# Altium schematic sheet Current sensors.SchDoc
size A4; SheetNumber: 4; SheetTotal: 4
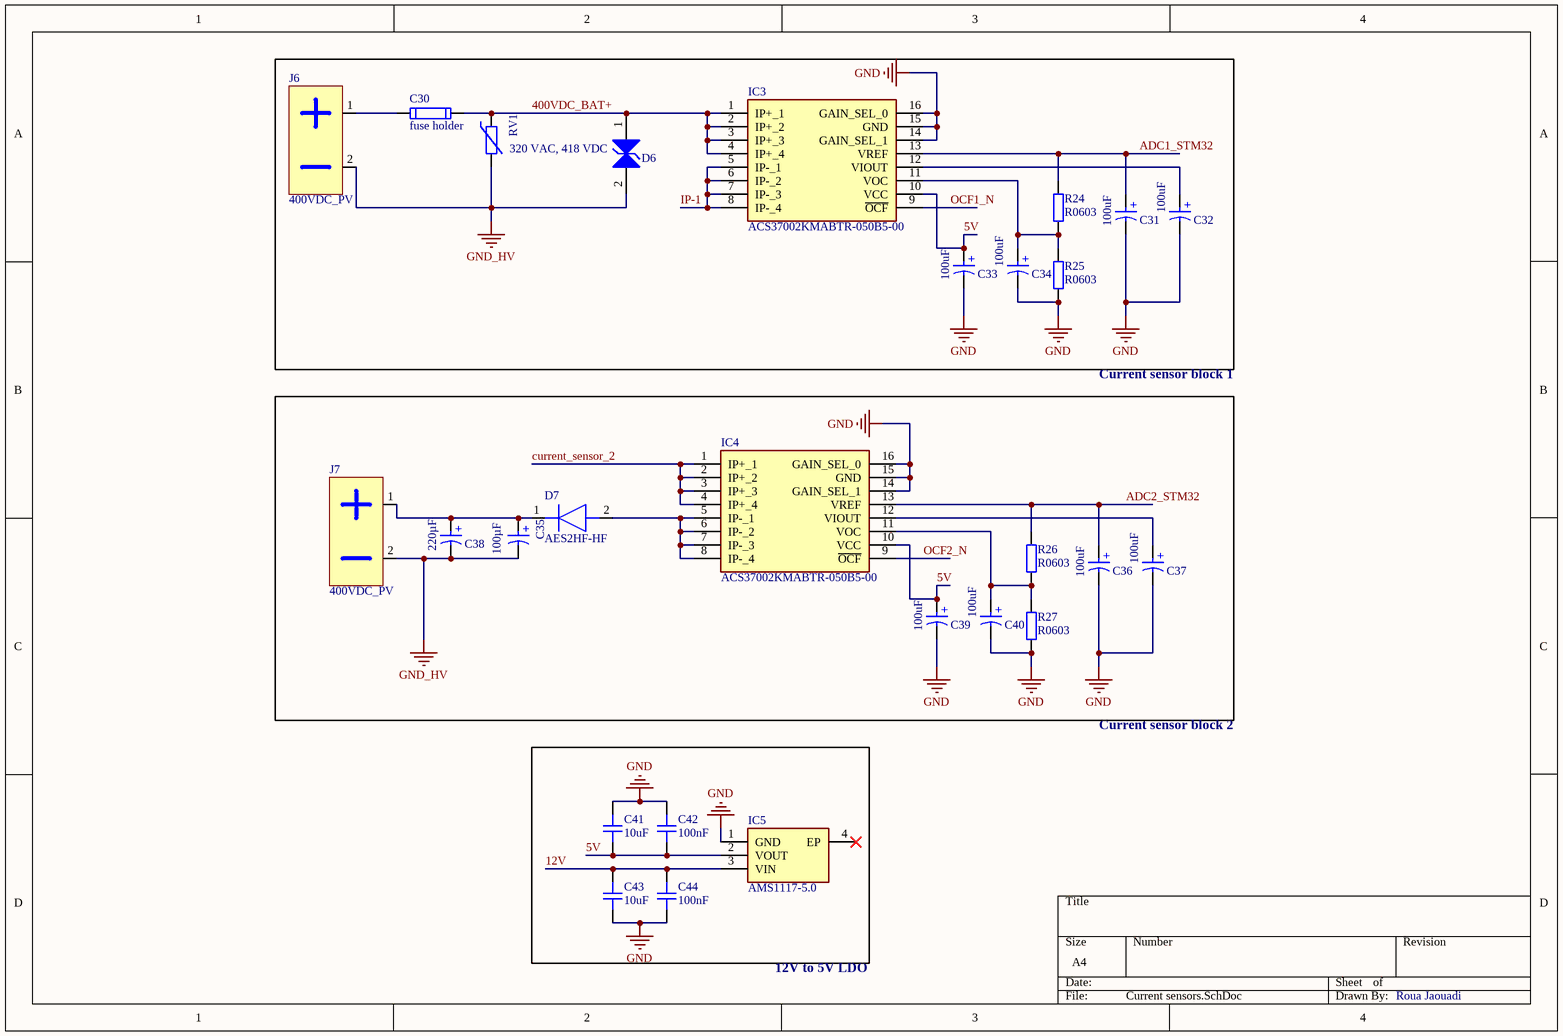
[diagram p0: Current sensors.SchDoc]

## Parts
C30  fuse holder  [696108003002]
C31  100uF  [WCAP-ATG8_D5H11]
C32  100uF  [WCAP-ATG8_D5H11]
C33  100uF  [WCAP-ATG8_D5H11]
C34  100uF  [WCAP-ATG8_D5H11]
C35  100µF  [WCAP-AT1H_D16H35.5]
C36  100uF  [WCAP-ATG8_D5H11]
C37  100uF  [WCAP-ATG8_D5H11]
C38  220µF  [WCAP-AIE8_D25H40]
C39  100uF  [WCAP-ATG8_D5H11]
C40  100uF  [WCAP-ATG8_D5H11]
C41  10uF  [CAP_0603]
C42  100nF  [CAP_0603]
C43  10uF  [CAP_0603]
C44  100nF  [CAP_0603]
D6  600W, 5VDC  [WE-TVSP_DO-214AA_Bidirectional]  (value not drawn)
D7  AES2HF-HF  [SODFL5226X110N]
IC3  ACS37002KMABTR-050B5-00  [SOIC127P1030X265-16N]
IC4  ACS37002KMABTR-050B5-00  [SOIC127P1030X265-16N]
IC5  AMS1117-5.0  [SOT290P700X180-4N]
J6  400VDC_PV  [XT60PW-F]
J7  400VDC_PV  [XT60PW-F]
R24  R0603  [RES_0603]
R25  R0603  [RES_0603]
R26  R0603  [RES_0603]
R27  R0603  [RES_0603]
RV1  320 VAC, 418 VDC  [D16.5W7.2H20.5P1.6]

## Blocks framed on the sheet
Current sensor block 1: C35-C40 D7 IC4 J7 R26 R27

## Nets
GND: C31.2(N) C32.2(N) C33.2(N) C34.2(N) C36.2(N) C37.2(N) C39.2(N) C40.2(N) C41.1 C42.1 C43.2 C44.2 IC3.14(GAIN_SEL_1) IC3.15(GND) IC3.16(GAIN_SEL_0) IC4.14(GAIN_SEL_1) IC4.15(GND) IC4.16(GAIN_SEL_0) IC5.1(GND) R25.2 R27.2
GND_HV: C35.2(N) C38.2(N) D6.2 J6.2(V-) J7.2(V-) RV1.2
5V: C33.1(P) C39.1(P) C41.2 C42.2 IC3.10(VCC) IC4.10(VCC) IC5.2(VOUT)
12V: C43.1 C44.1 IC5.3(VIN)
400VDC_BAT+: C30.2 D6.1 IC3.1(IP+_1) IC3.2(IP+_2) IC3.3(IP+_3) IC3.4(IP+_4) RV1.1
ADC1_STM32: C31.1(P) IC3.13(VREF) R24.1
ADC2_STM32: C36.1(P) IC4.13(VREF) R26.1
current_sensor_2: IC4.1(IP+_1) IC4.2(IP+_2) IC4.3(IP+_3) IC4.4(IP+_4)
IP-1: IC3.5(IP-_1) IC3.6(IP-_2) IC3.7(IP-_3) IC3.8(IP-_4)
OCF1_N: IC3.9(~{OCF})
OCF2_N: IC4.9(~{OCF})
NetC30_1: C30.1 J6.1(V+)
NetC32_1: C32.1(P) IC3.12(VIOUT)
NetC34_1: C34.1(P) IC3.11(VOC) R24.2 R25.1
NetC35_1: C35.1(P) C38.1(P) D7.1(K) J7.1(V+)
NetC37_1: C37.1(P) IC4.12(VIOUT)
NetC40_1: C40.1(P) IC4.11(VOC) R26.2 R27.1
NetD7_2: D7.2(A) IC4.5(IP-_1) IC4.6(IP-_2) IC4.7(IP-_3) IC4.8(IP-_4)

Not connected (* = marked no-connect by the designer): IC5 4(EP)*

## Notes on the sheet
- Current sensor block 2
- 12V to 5V LDO
- Roua Jaouadi
- (in symbol 860010272005) +
- (in symbol 860241480001) +
- (in symbol 861221484011) +

## Library data of the parts
C30 = WE-FUSEHOLDER BLOCKS 696108003002: FUSEHOLDER BLOCKS - PCB - CLIP COVER - THT - WR-FSH; Manufacturer: W¨¹rth Elektronik eiSos GmbH; ComponentLink1 Description: Manufacturer; ComponentLink2 Description: Datasheet; NoPins: 2; ComponentLink1URL: http://www.we-online.de; ComponentLink2URL: http://katalog.we-online.de/em/datasheet/696108003002.pdf; Created by: Karrer Zheng; Created Date: 11/11/2014; partNo: 696108003002
C31-C34 C36 C37 C39 C40 = 860010272005: WCAP-ATG8 Aluminum Electrolytic Capacitor, Radial, THT, D5 x H11mm, 100uF, 10V; Manufacturer: Wurth Elektronik; Capacitance Tolerance: +/-20%; Dissipation Factor: 19%; Endurance: 2000h; Leakage Current: 10uA; Ripple Current: 198mA; Technical Reference: ATBC110101M010DSPA3B000; Manufacturer Part Number: 860010272005; Category: Aluminum Electrolytic Capacitors; Match Code: WCAP-ATG8; ComponentLink1Description: Website Link; ComponentLink1URL: https://www.we-online.com/redexpert/article/860010272005?ad; ComponentLink2Description: Datasheet Link; ComponentLink2URL: https://www.we-online.com/redexpert/spec/860010272005?ad; Mount: Through Hole; Operating Temperature Max: 85°C; Operating Temperature Min: -40°C; Packaging: Ammo Pack; Height: 11mm; Diameter: 5mm; Capacitance: 100uF; Rated Voltage (DC): 10V
C35 = 860241480001: WCAP-AT1H Aluminum Electrolytic Capacitor, Radial, D16 x H35.5mm, 100µF, 450V; Manufacturer: Wurth Elektronik; Capacitance Tolerance: +/-20%; Dissipation Factor: 17%; Endurance: 5000h; Leakage Current: 1900µA; Ripple Current: 610mA; Technical Reference: ATJK355101M450DSPADE000; Manufacturer Part Number: 860241480001; Category: Aluminum Electrolytic Capacitors; Match Code: WCAP-AT1H; ComponentLink1Description: Website Link; ComponentLink1URL: https://www.we-online.com/redexpert/article/860241480001?ad; ComponentLink2Description: Datasheet Link; ComponentLink2URL: https://www.we-online.com/redexpert/spec/860241480001?ad; Mount: Through Hole; Min Operating Temperature: -25°C; Max Operating Temperature: 105°C; Packaging: Ammo Pack; Case/Size Code: D16 x H35.5mm; Height: 35.5mm; Diameter: 16mm; Capacitance: 100µF; Rated Voltage (DC): 450V
C38 = 861221484011: WCAP-AIE8 Aluminum Electrolytic Capacitor, Snap-In, D25 x H40mm, 220µF, 450V; Manufacturer: Wurth Elektronik; Capacitance Tolerance: +/-20%; Dissipation Factor: 20%; Endurance: 3000h; Leakage Current: 943.93µA; Ripple Current: 1590mA; Technical Reference: ANAO400221M450DSIC3C000; Manufacturer Part Number: 861221484011; Category: Aluminum Electrolytic Capacitors; Match Code: WCAP-AIE8; ComponentLink1Description: Website Link; ComponentLink1URL: https://www.we-online.com/redexpert/article/861221484011?ad; ComponentLink2Description: Datasheet Link; ComponentLink2URL: https://www.we-online.com/redexpert/spec/861221484011?ad; Mount: Through Hole; Operating Temperature Max: 85°C; Operating Temperature Min: -25°C; Packaging: Tray; Height: 40mm; Diameter: 25mm; Capacitance: 220µF; Rated Voltage (DC): 450V
C41-C44 = CAP_0603: Capacitor SMD 0603; Manufacturer: *; Manufacturer Part Number: *; Distributor Link: *; LCSC: *; Rating: *; Dielectric: *
D6 = 824521500: WE-TVSP SMT Power TVS Diode, DO-214AA, Bidirectional, 600W, 5VDC; Manufacturer: Wurth Elektronik; Clamping Voltage: 9.2V; Operating Voltage (DC): 5V; (Reverse) Breakdown Voltage: 6.7V; (Reverse) Peak Pulse Current: 65.3A; ComponentLink1Description: Website Link; ComponentLink1URL: https://www.we-online.com/redexpert/article/824521500?ad; ComponentLink2Description: Datasheet Link; ComponentLink2URL: https://www.we-online.com/redexpert/spec/824521500?ad; Manufacturer Part Number: 824521500; Category: Surge Protection; Match Code: WE-TVSP; Mount: Surface Mount; Operating Temperature Max: 150°C; Operating Temperature Min: -65°C; Packaging: Tape and Reel; Case/Size Code: DO-214AA; Length: 4.32mm; Width: 3.62mm; Height: 2.4mm; Polarity: Bidirectional; Power Dissipation: 600W
D7 = AES2HF-HF: Diode; Manufacturer_Name: Comchip Technology; Datasheet Link: https://www.comchiptech.com/product.php?id=12661; Height: 1.1mm; Manufacturer_Part_Number: AES2HF-HF; Mouser Part Number: 750-AES2HF-HF; Mouser Price/Stock: https://www.mouser.co.uk/ProductDetail/Comchip-Technology/AES2HF-HF?qs=GBLSl2Akirufo1pW%252B4BBNA%3D%3D
IC3 IC4 = ACS37002KMABTR-050B5-00: Integrated Circuit; Manufacturer_Name: Allegro Microsystems; Datasheet Link: https://www.allegromicro.com/en/products/sense/current-sensor-ics/zero-to-fifty-amp-integrated-conductor-sensor-ics/acs37002; Height: 2.65mm; Manufacturer_Part_Number: ACS37002KMABTR-050B5-00
IC5 = AMS1117-5.0: Integrated Circuit; Manufacturer_Name: Shikues; Datasheet Link: https://datasheet.lcsc.com/szlcsc/SK-AMS1117-5-0_C165483.pdf; Height: 1.8mm; Manufacturer_Part_Number: AMS1117-5.0
J6 J7 = XT60PW-F: XT60 horizontal female 2-pin AMASS; Manufacturer: AMASS; Manufacturer Part Number: XT60PW-F; Distributor Link: https://www.tme.eu/de/details/xt60pw-f/dc-steckverbinder/amass/
R24-R27 = RES_0603: Resistor SMD 0603; Manufacturer: *; Manufacturer Part Number: *; Distributor Link: *; LCSC: *
RV1 = 820443211E: WE-VD Disk Varistor, D16.5 x H20.5 mm, 320 VAC, 418 VDC; Manufacturer: Wurth Elektronik; Channel Input Capacitance: 370 pF; Clamping Voltage: 842 V; Energy Absorption: 190 J; Operating Voltage (AC): 320 V; Operating Voltage (DC): 418 V; Power Dissipation: 0.6 W; (Reverse) Breakdown Voltage: 510 V; (Reverse) Peak Pulse Current: 6000 A; Manufacturer Part Number: 820443211E; Category: Surge Protection; Match Code: WE-VD; ComponentLink1Description: Website Link; ComponentLink1URL: https://www.we-online.com/redexpert/article/820443211E?ad; ComponentLink2Description: Datasheet Link; ComponentLink2URL: https://www.we-online.com/redexpert/spec/820443211E?ad; Mount: Through Hole; Min Operating Temperature: -40 °C; Max Operating Temperature: 105 °C; Packaging: Tape and Reel; Width: 7.2 mm; Height: 20.5 mm; Diameter: 16.5 mm